# EAGLE design Vers. 6 Moppy Board (EAGLE 9.1.3)
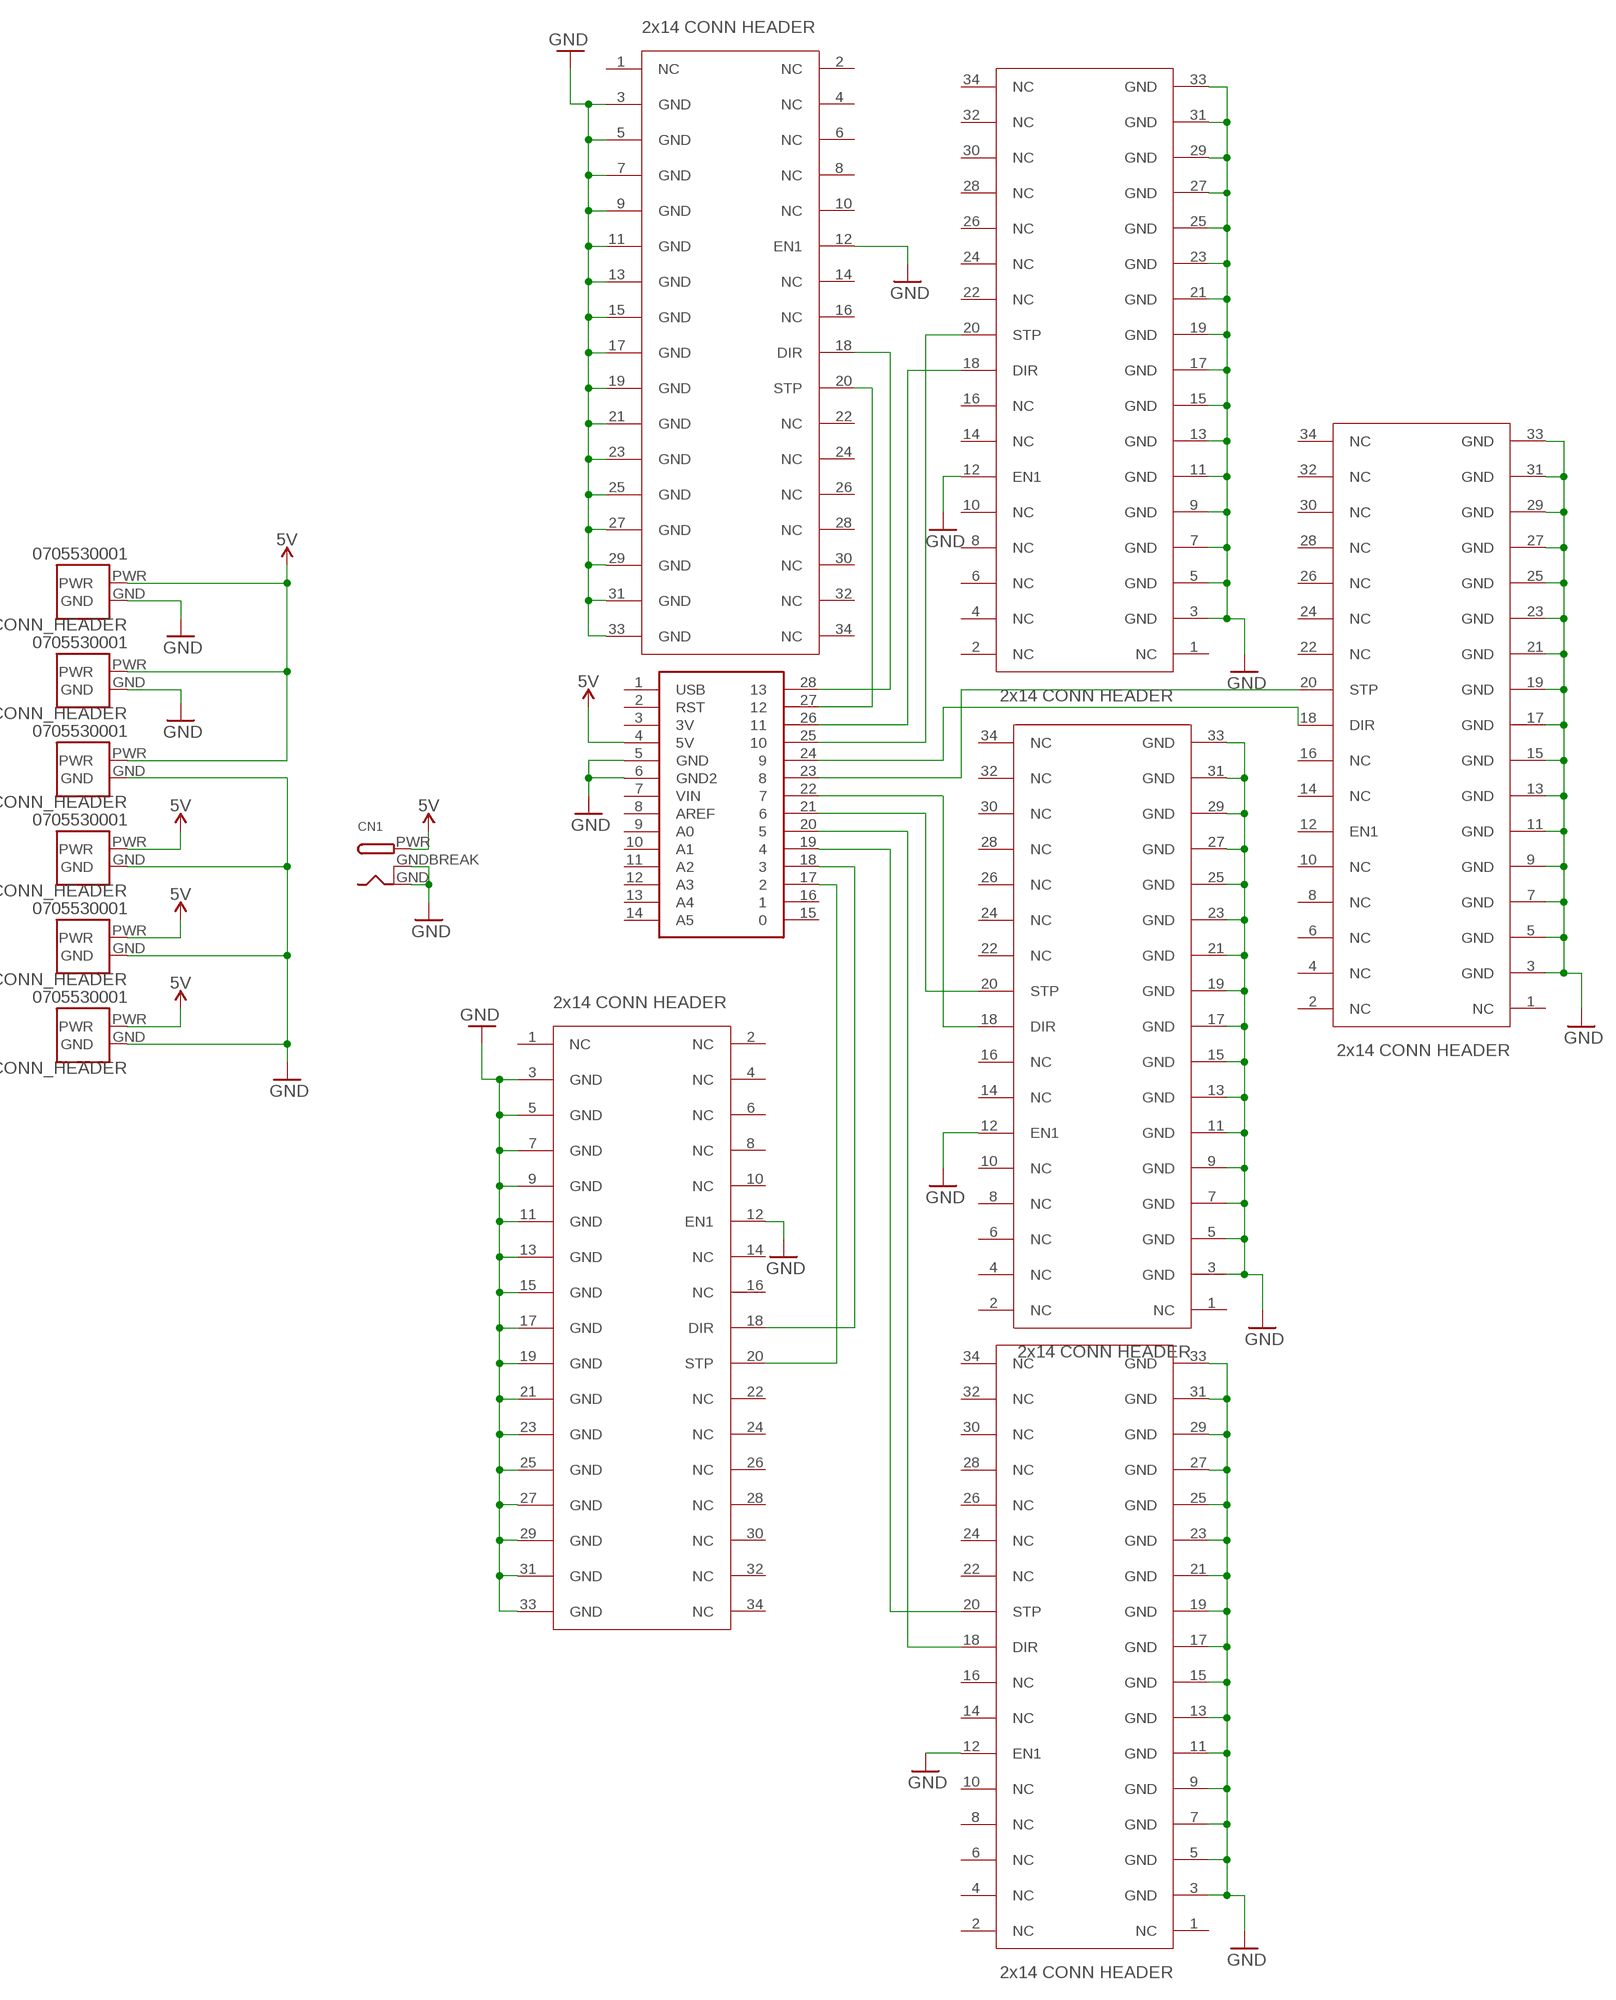
[diagram p0: schematic, sheet 1]

## Parts
CN1  DCBARRELPTH  [DCJACK_2MM_PTH]
U$1  2X14_CONN_HEADER  [2X17_CONN_HEADER]
U$2  2X14_CONN_HEADER  [2X17_CONN_HEADER]
U$3  2X14_CONN_HEADER  [2X17_CONN_HEADER]
U$4  2X14_CONN_HEADER  [2X17_CONN_HEADER]
U$5  2X14_CONN_HEADER  [2X17_CONN_HEADER]
U$6  2X14_CONN_HEADER  [2X17_CONN_HEADER]
U$8  METROMINI  [METROMINI]
X1  0705530001  [MOLEX_0705530001]
X2  0705530001  [MOLEX_0705530001]
X3  0705530001  [MOLEX_0705530001]
X4  0705530001  [MOLEX_0705530001]
X5  0705530001  [MOLEX_0705530001]
X6  0705530001  [MOLEX_0705530001]

## Nets
5V: CN1.PWR U$8.4(5V) X1.PWR X2.PWR X3.PWR X4.PWR X5.PWR X6.PWR
GND: CN1.GND CN1.GNDBREAK U$1.3(GND) U$1.5(GND) U$1.7(GND) U$1.9(GND) U$1.11(GND) U$1.12(EN1) U$1.13(GND) U$1.15(GND) U$1.17(GND) U$1.19(GND) U$1.21(GND) U$1.23(GND) U$1.25(GND) U$1.27(GND) U$1.29(GND) U$1.31(GND) U$1.33(GND) U$2.3(GND) U$2.5(GND) U$2.7(GND) U$2.9(GND) U$2.11(GND) U$2.12(EN1) U$2.13(GND) U$2.15(GND) U$2.17(GND) U$2.19(GND) U$2.21(GND) U$2.23(GND) U$2.25(GND) U$2.27(GND) U$2.29(GND) U$2.31(GND) U$2.33(GND) U$3.3(GND) U$3.5(GND) U$3.7(GND) U$3.9(GND) U$3.11(GND) U$3.12(EN1) U$3.13(GND) U$3.15(GND) U$3.17(GND) U$3.19(GND) U$3.21(GND) U$3.23(GND) U$3.25(GND) U$3.27(GND) U$3.29(GND) U$3.31(GND) U$3.33(GND) U$4.3(GND) U$4.5(GND) U$4.7(GND) U$4.9(GND) U$4.11(GND) U$4.12(EN1) U$4.13(GND) U$4.15(GND) U$4.17(GND) U$4.19(GND) U$4.21(GND) U$4.23(GND) U$4.25(GND) U$4.27(GND) U$4.29(GND) U$4.31(GND) U$4.33(GND) U$5.3(GND) U$5.5(GND) U$5.7(GND) U$5.9(GND) U$5.11(GND) U$5.12(EN1) U$5.13(GND) U$5.15(GND) U$5.17(GND) U$5.19(GND) U$5.21(GND) U$5.23(GND) U$5.25(GND) U$5.27(GND) U$5.29(GND) U$5.31(GND) U$5.33(GND) U$6.3(GND) U$6.5(GND) U$6.7(GND) U$6.9(GND) U$6.11(GND) U$6.13(GND) U$6.15(GND) U$6.17(GND) U$6.19(GND) U$6.21(GND) U$6.23(GND) U$6.25(GND) U$6.27(GND) U$6.29(GND) U$6.31(GND) U$6.33(GND) U$8.5(GND) U$8.6(GND2) X1.GND X2.GND X3.GND X4.GND X5.GND X6.GND
N$1: U$2.18(DIR) U$8.28
N$2: U$2.20(STP) U$8.27
N$3: U$3.18(DIR) U$8.26
N$4: U$3.20(STP) U$8.25
N$5: U$5.18(DIR) U$8.22
N$6: U$5.20(STP) U$8.21
N$7: U$1.20(STP) U$8.17
N$8: U$4.20(STP) U$8.19
N$9: U$1.18(DIR) U$8.18
N$10: U$6.18(DIR) U$8.24
N$11: U$4.18(DIR) U$8.20
N$12: U$6.20(STP) U$8.23
Unconnected: U$1.1(NC) U$1.2(NC) U$1.4(NC) U$1.6(NC) U$1.8(NC) U$1.10(NC) U$1.14(NC) U$1.16(NC) U$1.22(NC) U$1.24(NC) U$1.26(NC) U$1.28(NC) U$1.30(NC) U$1.32(NC) U$1.34(NC) U$2.1(NC) U$2.2(NC) U$2.4(NC) U$2.6(NC) U$2.8(NC) U$2.10(NC) U$2.14(NC) U$2.16(NC) U$2.22(NC) U$2.24(NC) U$2.26(NC) U$2.28(NC) U$2.30(NC) U$2.32(NC) U$2.34(NC) U$3.1(NC) U$3.2(NC) U$3.4(NC) U$3.6(NC) U$3.8(NC) U$3.10(NC) U$3.14(NC) U$3.16(NC) U$3.22(NC) U$3.24(NC) U$3.26(NC) U$3.28(NC) U$3.30(NC) U$3.32(NC) U$3.34(NC) U$4.1(NC) U$4.2(NC) U$4.4(NC) U$4.6(NC) U$4.8(NC) U$4.10(NC) U$4.14(NC) U$4.16(NC) U$4.22(NC) U$4.24(NC) U$4.26(NC) U$4.28(NC) U$4.30(NC) U$4.32(NC) U$4.34(NC) U$5.1(NC) U$5.2(NC) U$5.4(NC) U$5.6(NC) U$5.8(NC) U$5.10(NC) U$5.14(NC) U$5.16(NC) U$5.22(NC) U$5.24(NC) U$5.26(NC) U$5.28(NC) U$5.30(NC) U$5.32(NC) U$5.34(NC) U$6.1(NC) U$6.2(NC) U$6.4(NC) U$6.6(NC) U$6.8(NC) U$6.10(NC) U$6.12(EN1) U$6.14(NC) U$6.16(NC) U$6.22(NC) U$6.24(NC) U$6.26(NC) U$6.28(NC) U$6.30(NC) U$6.32(NC) U$6.34(NC) U$8.1(USB) U$8.2(RST) U$8.3(3V) U$8.7(VIN) U$8.8(AREF) U$8.9(A0) U$8.10(A1) U$8.11(A2) U$8.12(A3) U$8.13(A4) U$8.14(A5) U$8.15 U$8.16

## Library data of the parts
CN1 = adafruit:DCBARREL: 2.0mm DC Barrel Jack DCJACK_2MM_PTH - Through Hole Jack (4UConnector: 05537)
U$1-U$6 = Danielle's Library:2X14_CONN_HEADER
U$8 = MetroMINI:METROMINI
X1-X6 = 2.54_CONN_HEADER:0705530001: Conn Shrouded Header HDR 2 POS 2.54mm Solder RA Thru-Hole SLÃ¢âÂ¢ Tube; DESCRIPTION: Conn Shrouded Header HDR 2 POS 2.54mm Solder RA Thru-Hole SLÃ¢âÂ¢ Tube; DIGI-KEY_PART_NUMBER: WM4900-ND; DIGI-KEY_PURCHASE_URL: https://www.digikey.com/product-detail/en/molex/0705530001/WM4900-ND/114951?utm_source=snapeda&utm_medium=aggregator&utm_campaign=symbol; MF: Molex; MP: 0705530001; PACKAGE: None

## Board
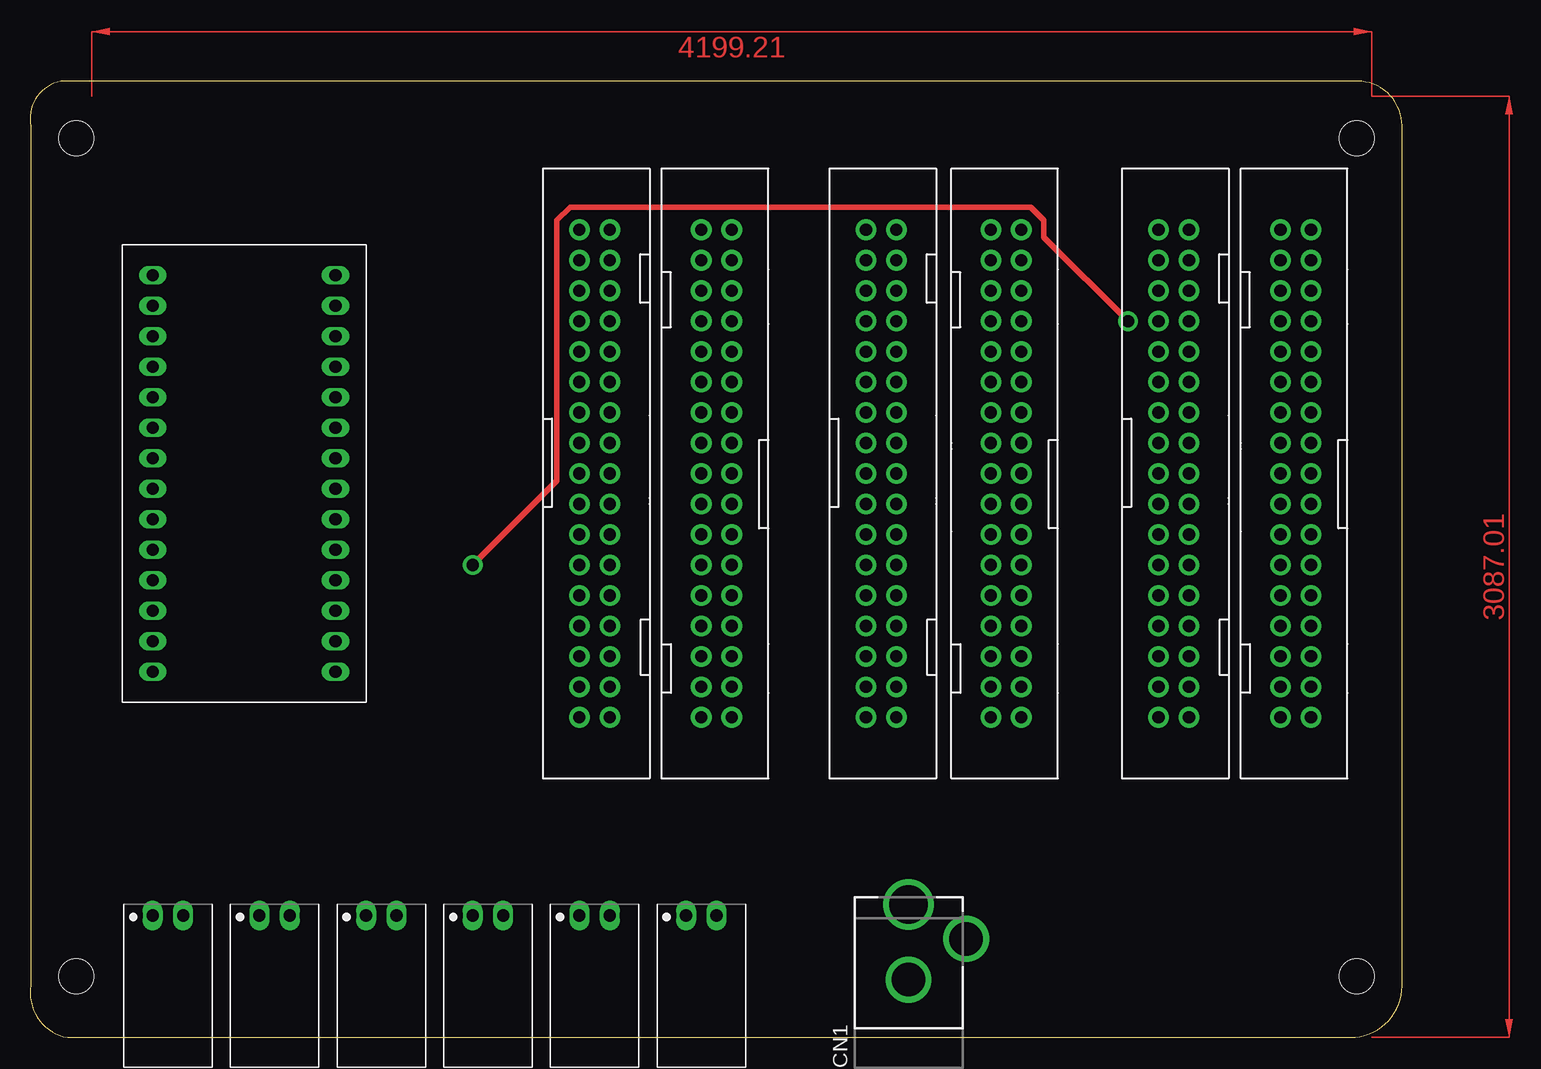
[diagram p1: board, top side]
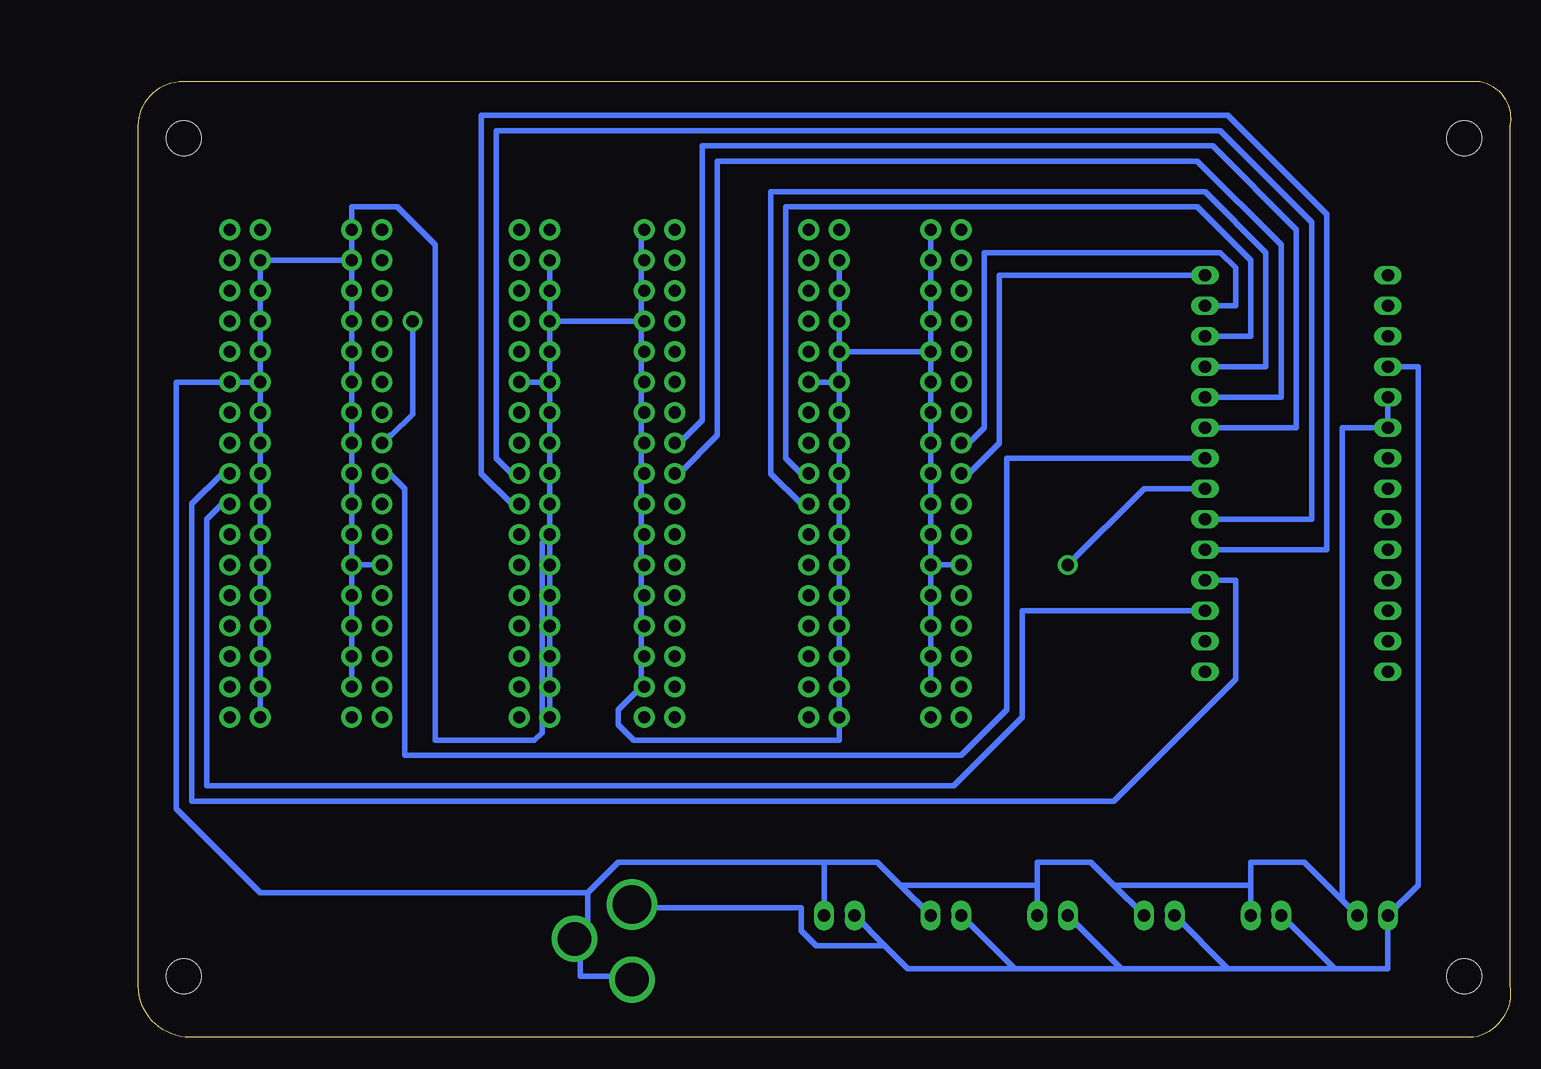
[diagram p2: board, bottom side, seen from below]

Size 114.34 x 79.68 mm. Coordinates in mm from the lower left corner, seen from the top.
Outline: 114.34,4.3 114.34,75.96 arc90 110.62,79.68 2.55,79.68 arc90 0.06,75.92 0.06,4.34 arc90 3.13,0 110.04,0 arc90 114.34,4.3
Copper layers (1*16): Top 0.035mm / dielectric 1.5mm / Bottom 0.035mm
Design rules "OthermillDRC_1_32_v2 *": minimum track width 18mil, minimum drill 0.8mm, track to track 0.794003125mm, track to pad 0.794003125mm, pad to pad 0.794003125mm, via to via 0.794003125mm, smd to smd 0mil, copper to edge 0mil, drill to drill 1mil, minimum pad ring 10mil, minimum via ring 10mil, stop-mask expansion 1mil, vias tented up to drill 30mil, thermal gap 10mil
Holes 2.9 mm at 110.55,5.08 3.87,74.93 110.55,74.93 3.87,5.08

### Footprints (pad centres in the part's own frame; a part is rotated, then mirrored left to right if it is on the bottom)
DCJACK_2MM_PTH = drill 2.8: GND 0,7.35; GNDBREAK 4.8,10.75 | drill 3.2: PWR 0,13.6
2X17_CONN_HEADER = drill 1.016 pad 1.727: 1 -25.4,-5.08; 2 -25.4,-2.54; 3 -22.86,-5.08; 4 -22.86,-2.54; 5 -20.32,-5.08; 6 -20.32,-2.54; 7 -17.78,-5.08; 8 -17.78,-2.54; 9 -15.24,-5.08; 10 -15.24,-2.54; 11 -12.7,-5.08; 12 -12.7,-2.54; 13 -10.16,-5.08; 14 -10.16,-2.54; 15 -7.62,-5.08; 16 -7.62,-2.54; 17 -5.08,-5.08; 18 -5.08,-2.54; 19 -2.54,-5.08; 20 -2.54,-2.54; 21 0,-5.08; 22 0,-2.54; 23 2.54,-5.08; 24 2.54,-2.54; 25 5.08,-5.08; 26 5.08,-2.54; 27 7.62,-5.08; 28 7.62,-2.54; 29 10.16,-5.08; 30 10.16,-2.54; 31 12.7,-5.08; 32 12.7,-2.54; 33 15.24,-5.08; 34 15.24,-2.54
METROMINI = drill 1.016 long: 1 -11.43,0; 2 -8.89,0; 3 -6.35,0; 4 -3.81,0; 5 -1.27,0; 6 1.27,0; 7 3.81,0; 8 6.35,0; 9 8.89,0; 10 11.43,0; 11 13.97,0; 12 16.51,0; 13 19.05,0; 14 21.59,0; 15 21.59,15.24; 16 19.05,15.24; 17 16.51,15.24; 18 13.97,15.24; 19 11.43,15.24; 20 8.89,15.24; 21 6.35,15.24; 22 3.81,15.24; 23 1.27,15.24; 24 -1.27,15.24; 25 -3.81,15.24; 26 -6.35,15.24; 27 -8.89,15.24; 28 -11.43,15.24
MOLEX_0705530001 = drill 1.016 pad 1.651 long: GND 2.54,0; PWR 0,0

### Placement (x,y rotation side)
CN1  73.22,-2.54 0 top
U$1  109.28,41.91 270 top
U$2  43.24,52.07 90 top
U$3  61.02,41.91 270 top
U$4  85.15,41.91 270 top
U$5  91.5,52.07 90 top
U$6  67.12,52.07 90 top
U$8  10.22,52.07 270 top
X1  54.67,10.16 0 top
X2  45.78,10.16 0 top
X3  10.22,10.16 0 top
X4  19.11,10.16 0 top
X5  28,10.16 0 top
X6  36.89,10.16 0 top

### Tracks (layer width: path | path; a pad name or v marks a point on that pad's centre or on a via)
5V
  Bottom 0.457: U$8.4 7.68,55.88 7.68,12.7 X3.PWR 10.22,5.72 14.67,5.72 | 14.67,5.72 X4.PWR | 23.56,5.72 X5.PWR | 14.67,5.72 23.56,5.72 | 32.45,5.72 X6.PWR | 23.56,5.72 32.45,5.72 | 41.34,5.72 X2.PWR | 32.45,5.72 41.34,5.72 | 52.13,7.62 50.23,5.72 41.34,5.72 | 52.13,7.62 X1.PWR | 52.13,7.62 57.85,7.62 59.12,8.89 59.12,10.79 73.09,10.79 CN1.PWR
GND
  Bottom 0.457: 72.45,64.77 72.45,67.31 U$6.33 | 72.45,62.23 72.45,59.69 | 72.45,57.15 72.45,54.61 | 72.45,52.07 72.45,49.53 | 72.45,46.99 72.45,44.45 | 72.45,41.91 72.45,39.37 | 72.45,31.75 72.45,29.21 | 72.45,36.83 72.45,34.29 | 72.45,34.29 72.45,31.75 | 72.45,31.75 U$6.5 | 72.45,34.29 U$6.7 | 72.45,36.83 72.45,39.37 | 72.45,39.37 U$6.11 | 72.45,36.83 U$6.9 | 72.45,41.91 72.45,44.45 | 72.45,44.45 U$6.15 | 72.45,41.91 U$6.13 | 72.45,46.99 72.45,49.53 | 72.45,49.53 U$6.19 | 72.45,46.99 U$6.17 | 72.45,52.07 72.45,54.61 | 72.45,54.61 U$6.23 | 72.45,52.07 U$6.21 | 72.45,57.15 72.45,59.69 | 72.45,57.15 U$6.25 | 72.45,62.23 72.45,64.77 | 72.45,64.77 U$6.31 | 72.45,62.23 U$6.29 | U$4.3 U$4.5 U$4.7 | U$4.7 U$4.9 U$4.11 | U$4.11 U$4.13 U$4.15 U$4.17 U$4.19 U$4.21 | U$4.11 U$4.12 | U$4.33 U$4.31 U$4.29 U$4.27 U$4.25 U$4.23 U$4.21 | U$4.7 72.45,59.69 | 72.45,59.69 U$6.27 | U$3.3 U$3.5 U$3.7 U$3.9 | U$3.11 U$3.13 U$3.15 U$3.17 U$3.19 U$3.21 U$3.23 U$3.25 U$3.27 U$3.29 U$3.31 U$3.33 55.94,24.76 73.09,24.76 74.36,26.04 74.36,27.3 72.45,29.21 | U$3.11 U$3.12 | U$3.11 U$3.9 | U$2.3 U$2.5 U$2.7 U$2.9 U$2.11 | U$2.33 U$2.31 U$2.29 U$2.27 U$2.25 | U$2.11 U$2.12 | U$2.11 U$2.13 U$2.15 U$2.17 U$2.19 U$2.21 U$2.23 U$2.25 | U$2.25 U$3.9 | 72.45,29.21 U$6.3 | U$8.5 U$8.6 14.03,50.8 14.03,11.43 | 14.03,11.43 17.21,14.61 21.65,14.61 21.65,12.7 | 14.03,11.43 X3.GND | X4.GND 21.65,12.7 | U$1.11 U$1.13 U$1.15 U$1.17 U$1.19 U$1.21 U$1.23 U$1.25 U$1.27 U$1.29 U$1.31 U$1.33 | U$1.11 U$1.12 111.19,54.61 111.19,19.05 104.2,12.06 76.9,12.06 | U$1.11 U$1.9 U$1.7 U$1.5 U$1.3 U$5.31 | U$5.3 U$5.5 U$5.7 U$5.9 U$5.11 | U$5.31 U$5.29 U$5.27 U$5.25 U$5.23 U$5.21 U$5.19 U$5.17 U$5.15 U$5.13 U$5.11
  Bottom 0.457: U$5.31 U$5.33 96.58,69.21 92.77,69.21 89.6,66.04 89.6,24.76 81.34,24.76 80.71,25.4 80.71,41.28 U$4.21 | U$5.11 U$5.12 | CN1.GND 73.72,5.08 77.53,5.08 77.53,7.62 CN1.GNDBREAK 77.53,8.25 76.9,8.89 76.9,12.06 | 33.08,12.7 34.99,14.61 39.43,14.61 39.43,12.7 | 33.08,12.7 X5.GND | X6.GND 39.43,12.7 | 50.86,12.7 52.77,14.61 57.21,14.61 | 50.86,12.7 X2.GND | X1.GND 57.21,14.61 | 50.86,12.7 39.43,12.7 | 76.9,12.06 74.36,14.61 57.21,14.61 | 33.08,12.7 21.65,12.7
N$1
  Bottom 0.457: U$8.28 42.61,63.5 42.61,49.53 45.15,46.99 U$2.18
N$2
  Bottom 0.457: U$8.27 22.92,60.96 22.92,64.13 24.19,65.41 43.88,65.41 43.88,50.8 45.15,49.53 U$2.20
N$3
  Bottom 0.457: U$8.26 21.65,58.42 21.65,64.77 26.1,69.21 60.39,69.21 60.39,48.26 59.12,46.99 U$3.18
N$4
  Bottom 0.457: U$8.25 20.38,55.88 20.38,65.41 25.46,70.48 61.66,70.48 61.66,46.99 59.12,44.45 U$3.20
N$5
  Bottom 0.457: U$8.22 41.97,48.26 41.97,27.3 45.78,23.49 92.14,23.49 92.14,45.72 93.41,46.99 U$5.18
N$6  (via drill 1.02 pad 1.65)
  Top 0.457: v36.89,39.37 43.9,46.37 43.9,68.09 45,69.2 83.39,69.2 84.5,68.09 84.5,66.69 v91.5,59.69
  Bottom 0.457: U$8.21 30.54,45.72 v36.89,39.37 | U$5.20 93.39,50.18 93.26,50.18 91.5,51.94 v91.5,59.69
N$7
  Bottom 0.457: U$8.17 40.7,35.56 40.7,26.67 46.42,20.95 108.65,20.95 108.65,43.18 107.38,44.45 U$1.20
N$8
  Bottom 0.457: U$8.19 15.3,40.64 15.3,68.58 23.56,76.83 85.79,76.83 85.79,46.99 83.25,44.45 U$4.20
N$9
  Bottom 0.457: U$8.18 22.92,38.1 22.92,29.85 33.08,19.68 109.92,19.68 109.92,44.45 107.38,46.99 U$1.18
N$10
  Bottom 0.457: U$8.24 19.11,53.34 19.11,66.04 26.1,73.02 66.1,73.02 66.1,50.16 69.28,46.99 U$6.18
N$11
  Bottom 0.457: U$8.20 16.57,43.18 16.57,67.94 24.19,75.56 84.52,75.56 84.52,48.26 83.25,46.99 U$4.18
N$12
  Bottom 0.457: U$8.23 17.84,50.8 17.84,67.31 24.83,74.3 67.37,74.3 67.37,51.44 69.28,49.53 U$6.20
(copper drawn outside any net)
  shapes: Top area x2